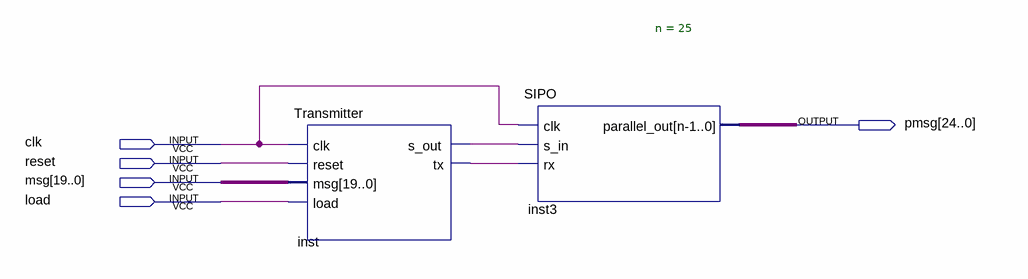
[diagram p0: schematic sheet]
// Quartus schematic Test_Transmitter.bdf as structural Verilog: 2 symbols, 5 pins
module Test_Transmitter (
  input  clk,
  input  reset,
  input  [19:0] msg,
  input  load,
  output [24:0] pmsg
);

  wire inst_s_out, inst_tx;

  Transmitter inst (.clk(clk), .reset(reset), .msg(msg), .load(load), .s_out(inst_s_out), .tx(inst_tx));
  SIPO #(.n(25)) inst3 (.clk(clk), .s_in(inst_s_out), .rx(inst_tx), .parallel_out(pmsg));
endmodule
